# EAGLE design optical meter reader (EAGLE 7.3.0)
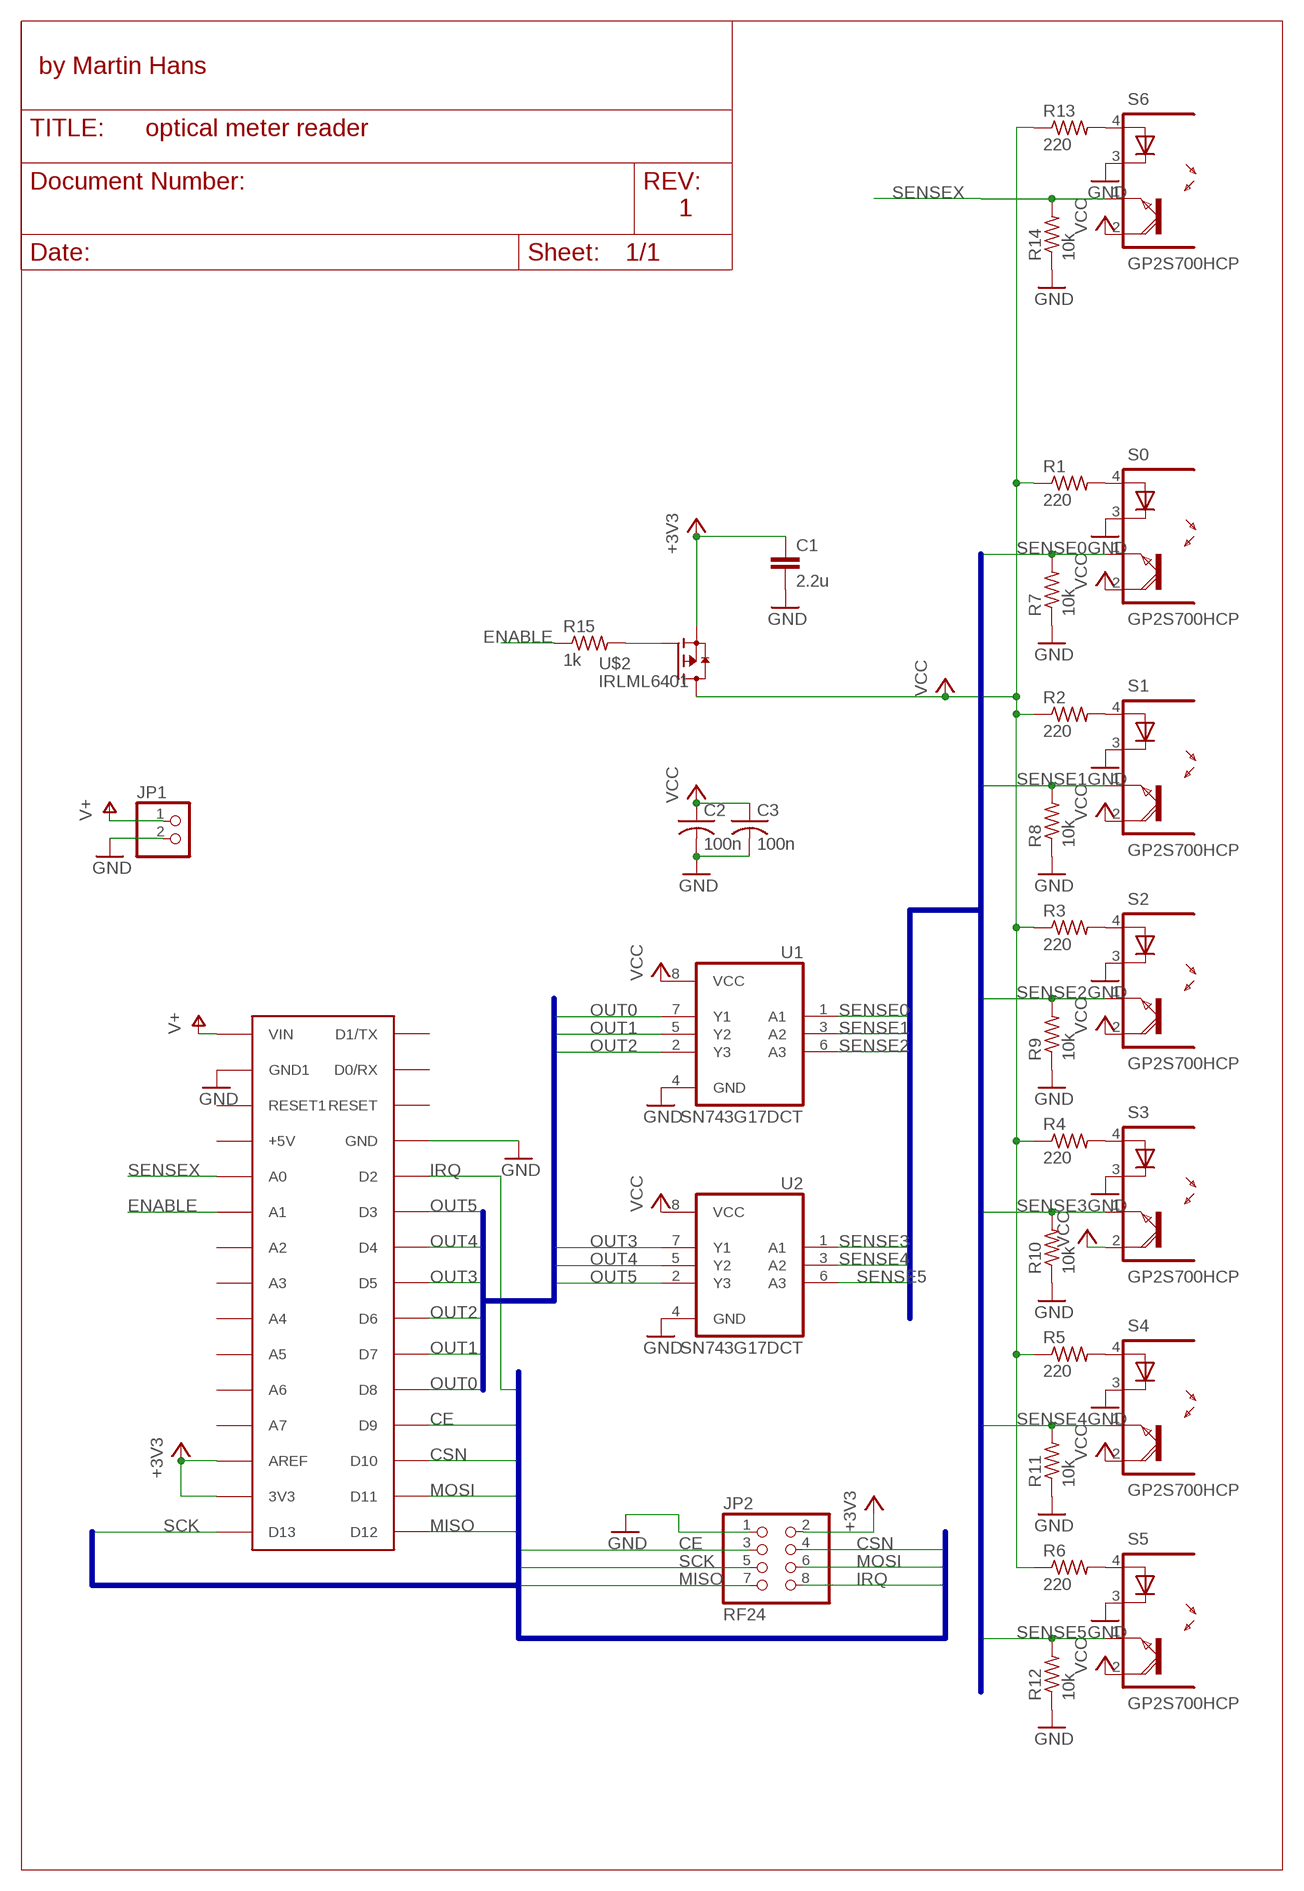
[diagram p0: schematic, sheet 1]

## Parts
C1  2.2u  C-EUC0603  [C0603]
C2  100n  C-USC0603  [C0603]
C3  100n  C-USC0603  [C0603]
JP1  PINHD-1X2  [1X02]
JP2  RF24  PINHD-2X4  [2X04]
R1  220  R-US_R0603  [R0603]
R2  220  R-US_R0603  [R0603]
R3  220  R-US_R0603  [R0603]
R4  220  R-US_R0603  [R0603]
R5  220  R-US_R0603  [R0603]
R6  220  R-US_R0603  [R0603]
R7  10k  R-US_R0603  [R0603]
R8  10k  R-US_R0603  [R0603]
R9  10k  R-US_R0603  [R0603]
R10  10k  R-US_R0603  [R0603]
R11  10k  R-US_R0603  [R0603]
R12  10k  R-US_R0603  [R0603]
R13  220  R-US_R0603  [R0603]
R14  10k  R-US_R0603  [R0603]
R15  1k  R-US_R0603  [R0603]
S0  GP2S700HCP  [SMD]
S1  GP2S700HCP  [SMD]
S2  GP2S700HCP  [SMD]
S3  GP2S700HCP  [SMD]
S4  GP2S700HCP  [SMD]
S5  GP2S700HCP  [SMD]
S6  GP2S700HCP  [SMD]
U1  SN743G17DCT  [SSOP08]
U2  SN743G17DCT  [SSOP08]
U$1  ARDUINONANO  [PDIP-32]
U$2  IRLML6401  [SOT23]

## Nets
+3V3: C1.1 JP2.2 U$1.3V3 U$1.AREF U$2.2(S)
CE: JP2.3 U$1.D9
CSN: JP2.4 U$1.D10
ENABLE: R15.1 U$1.A1
GND: C1.2 C2.2 C3.2 JP1.2 JP2.1 R7.1 R8.1 R9.1 R10.1 R11.1 R12.1 R14.1 S0.3(C) S1.3(C) S2.3(C) S3.3(C) S4.3(C) S5.3(C) S6.3(C) U1.4(GND) U2.4(GND) U$1.GND U$1.GND1
IRQ: JP2.8 U$1.D2
MISO: JP2.7 U$1.D12
MOSI: JP2.6 U$1.D11
N$1: R1.2 S0.4(A)
N$2: R2.2 S1.4(A)
N$3: R3.2 S2.4(A)
N$4: R4.2 S3.4(A)
N$5: R5.2 S4.4(A)
N$6: R13.2 S6.4(A)
N$7: R15.2 U$2.1(G)
N$8: R6.2 S5.4(A)
OUT0: U1.7(Y1) U$1.D8
OUT1: U1.5(Y2) U$1.D7
OUT2: U1.2(Y3) U$1.D6
OUT3: U2.7(Y1) U$1.D5
OUT4: U2.5(Y2) U$1.D4
OUT5: U2.2(Y3) U$1.D3
SCK: JP2.5 U$1.D13
SENSE0: R7.2 S0.1(EMI) U1.1(A1)
SENSE1: R8.2 S1.1(EMI) U1.3(A2)
SENSE2: R9.2 S2.1(EMI) U1.6(A3)
SENSE3: R10.2 S3.1(EMI) U2.1(A1)
SENSE4: R11.2 S4.1(EMI) U2.3(A2)
SENSE5: R12.2 S5.1(EMI) U2.6(A3)
SENSEX: R14.2 S6.1(EMI) U$1.A0
V+: JP1.1 U$1.VIN
VCC: C2.1 C3.1 R1.1 R2.1 R3.1 R4.1 R5.1 R6.1 R13.1 S0.2(COL) S1.2(COL) S2.2(COL) S3.2(COL) S4.2(COL) S5.2(COL) S6.2(COL) U1.8(VCC) U2.8(VCC) U$2.3(D)
Unconnected: U$1.+5V U$1.A2 U$1.A3 U$1.A4 U$1.A5 U$1.A6 U$1.A7 U$1.D0/RX U$1.D1/TX U$1.RESET U$1.RESET1

## Buses
SENSE[0..5]
OUT[0..5]
CSN,CE,MOSI,MISO,SCK,IRQ

## Notes on the sheet
- by Martin Hans
- 1

## Library data of the parts
C1 = rcl:C-EU: CAPACITOR, European symbol
C2 C3 = rcl:C-US: CAPACITOR, American symbol
JP1 = pinhead:PINHD-1X2: PIN HEADER
JP2 = pinhead:PINHD-2X4: PIN HEADER
R1-R15 = adafruit:R-US_: RESISTOR, American symbol
S0 S1-S6 = optoelectronics:GP2S700HCP
U1 U2 = logic:SN74*3G17
U$1 = arduino:ARDUINONANO
U$2 = transistors:IRLML6401

## Board
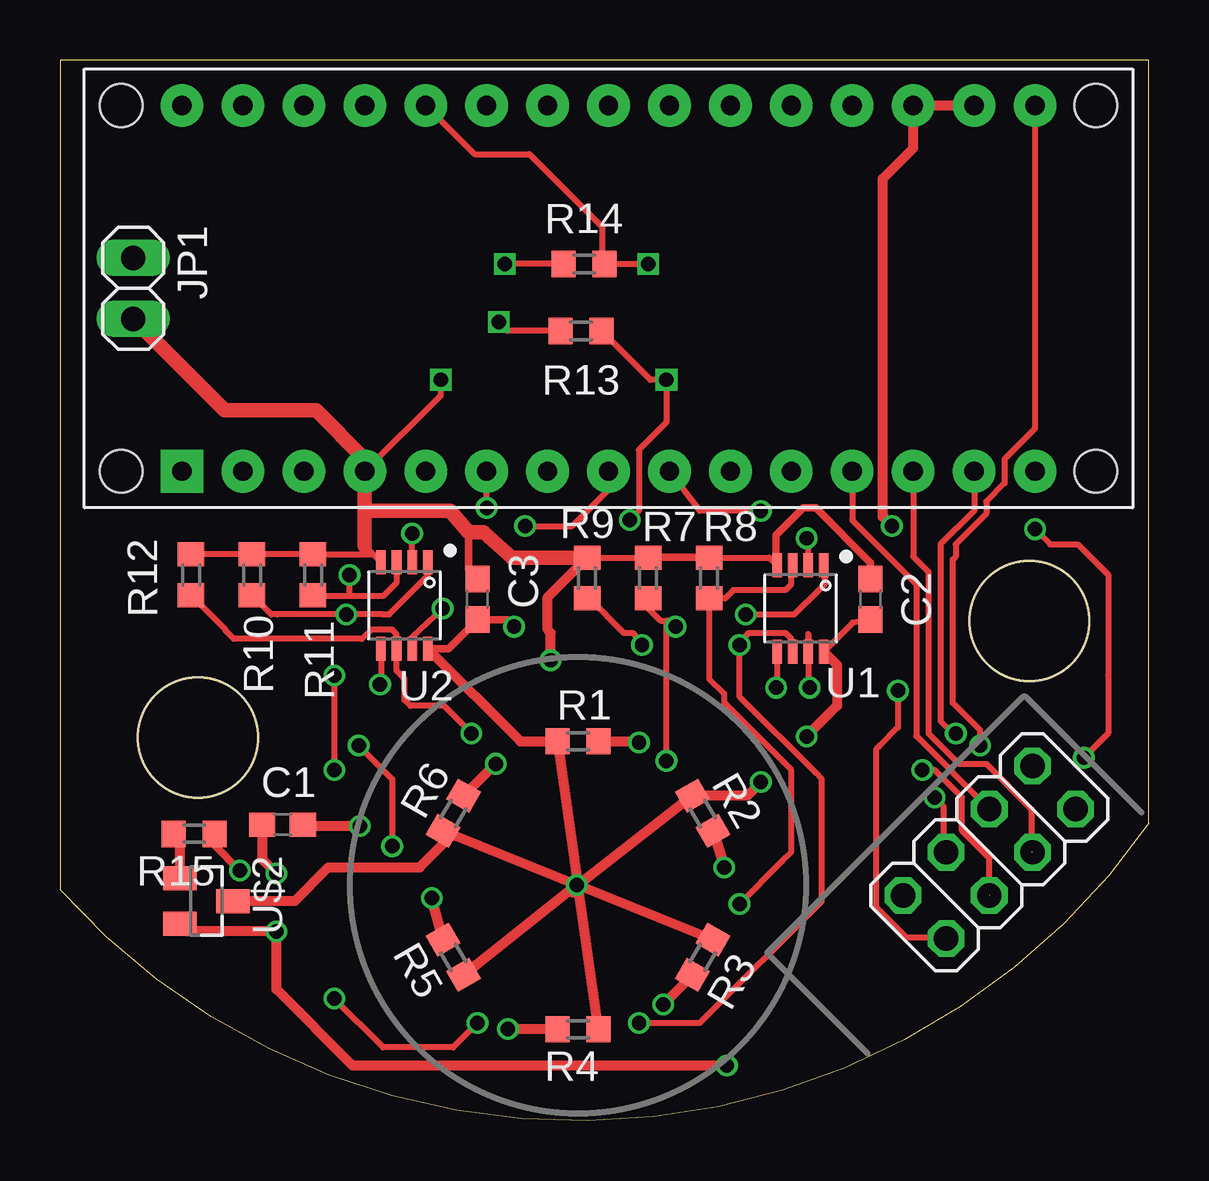
[diagram p1: board, top side]
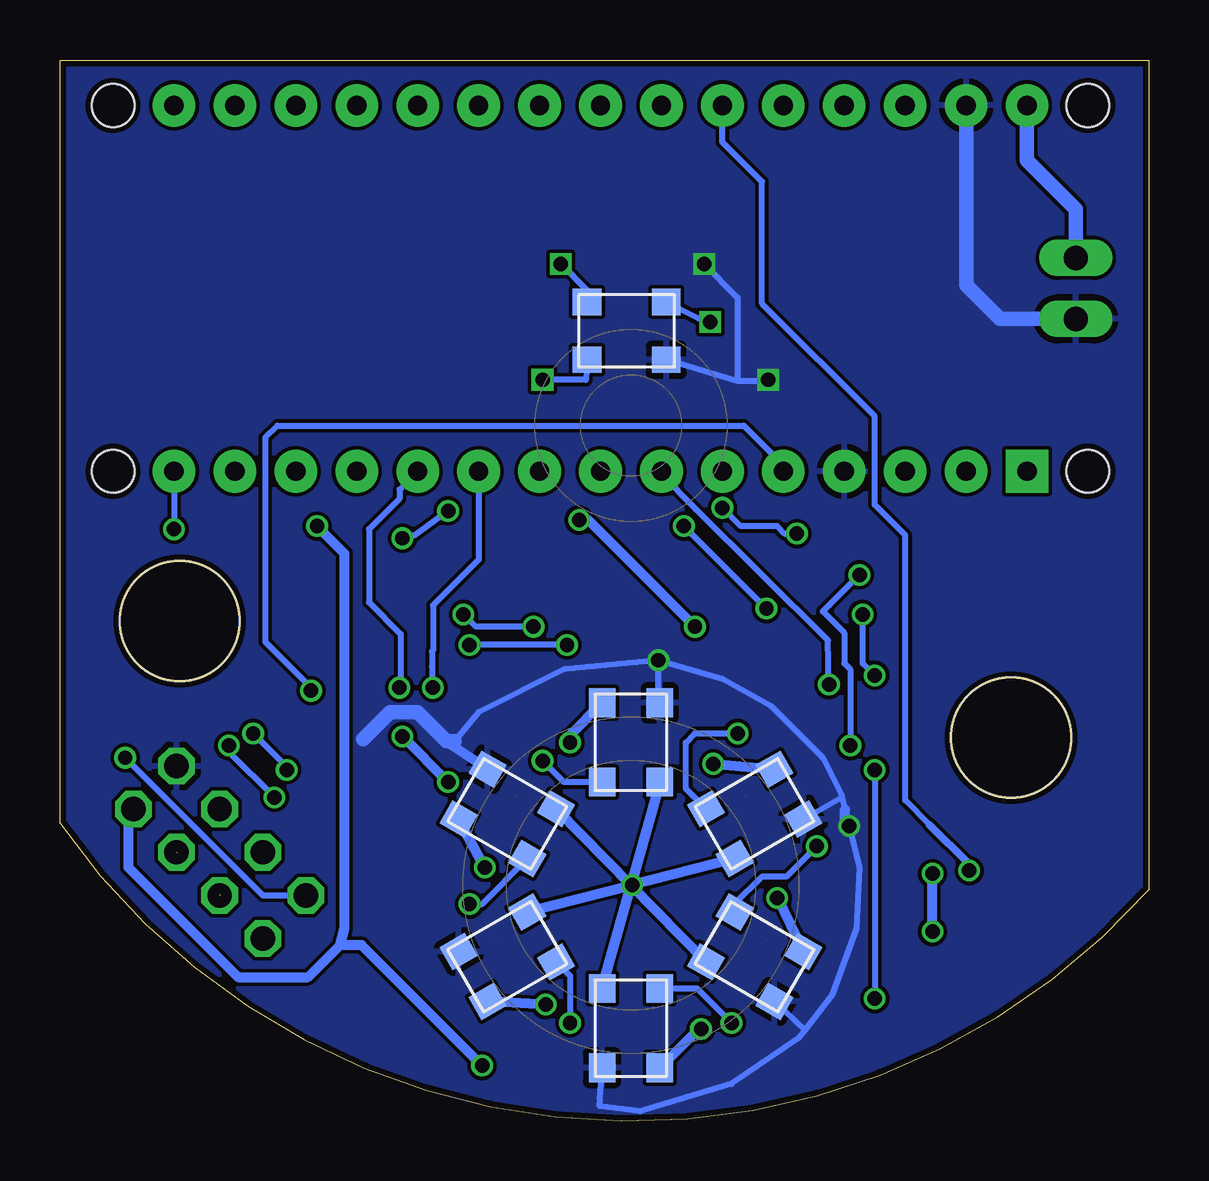
[diagram p2: board, bottom side, seen from below]

Size 45.4 x 44.21 mm. Coordinates in mm from the lower left corner, seen from the top.
Outline: 45.4,12.4 45.39,44.21 0,44.21 0,9.63 arc103 45.4,12.4
Outline: circle at 40.41,20.83 radius 2.5
Outline: circle at 5.75,15.97 radius 2.5
Copper layers (1*16): Top 0.035mm / dielectric 1.5mm / Bottom 0.035mm
Design rules "SeeedStudio_2layer_DRU_no_angle_20140221": minimum track width 6mil, minimum drill 12mil, track to track 6mil, track to pad 6mil, pad to pad 6mil, via to via 6mil, smd to smd 0mil, copper to edge 10mil, drill to drill 10mil, minimum pad ring 10mil, minimum via ring 6mil, stop-mask expansion 2mil, vias tented up to drill 100mil, thermal gap 10mil
Holes 5 mm at 5.75,15.97 40.41,20.83

### Footprints (pad centres in the part's own frame; a part is rotated, then mirrored left to right if it is on the bottom)
C0603 = smd 1.1 x 1: 1 -0.85,0; 2 0.85,0
1X02 = drill 1.016 long: 1 -1.27,0; 2 1.27,0
2X04 = drill 1.016 octagon: 1 -3.81,-1.27; 2 -3.81,1.27; 3 -1.27,-1.27; 4 -1.27,1.27; 5 1.27,-1.27; 6 1.27,1.27; 7 3.81,-1.27; 8 3.81,1.27
R0603 = smd 1 x 1.1: 1 -0.85,0; 2 0.85,0
SMD = smd 1.2 x 1.1: 1 -1.7,1.2; 2 -1.7,-1.2; 3 1.6,-1.2; 4 1.6,1.2
SSOP08 = smd 0.4 x 1: 1 -0.975,-1.8; 2 -0.325,-1.8; 3 0.325,-1.8; 4 0.975,-1.8; 5 0.975,1.8; 6 0.325,1.8; 7 -0.325,1.8; 8 -0.975,1.8
PDIP-32 = drill 0.8 pad 1.778: 3V3 15.24,-35.56; +5V 15.24,-10.16; A0 15.24,-12.7; A1 15.24,-15.24; A2 15.24,-17.78; A3 15.24,-20.32; A4 15.24,-22.86; A5 15.24,-25.4; A6 15.24,-27.94; A7 15.24,-30.48; AREF 15.24,-33.02; D0/RX 0,-5.08; D2 0,-12.7; D3 0,-15.24; D4 0,-17.78; D5 0,-20.32; D6 0,-22.86; D7 0,-25.4; D8 0,-27.94; D9 0,-30.48; D10 0,-33.02; D11 0,-35.56; D12 0,-38.1; D13 15.24,-38.1; GND 0,-10.16; GND1 15.24,-5.08; RESET 0,-7.62; RESET1 15.24,-7.62; VIN 15.24,-2.54 | drill 0.8 pad 1.778 square: D1/TX 0,-2.54 | hole 1.778: 0,0; 0,-40.64; 15.24,-40.64; 15.24,0
SOT23 = smd 1 x 1.4: 1 -0.95,-1.1; 2 0.95,-1.1; 3 0,1.1

### Placement (x,y rotation side)
C1  9.28,12.34 0 top
C2  33.79,21.74 90 top
C3  17.4,21.74 90 top
JP1  3.05,34.69 270 top
JP2  38.74,11.2 225 top
R1  21.59,15.82 0 top
R2  26.79,12.82 300 top
R3  26.79,6.82 240 top
R4  21.59,3.82 180 top
R5  16.4,6.82 120 top
R6  16.4,12.82 60 top
R7  24.52,22.63 270 top
R8  27.06,22.63 270 top
R9  21.98,22.63 270 top
R10  8.01,22.75 270 top
R11  10.55,22.75 270 top
R12  5.47,22.75 270 top
R13  21.72,32.92 180 top
R14  21.85,35.71 0 top
R15  5.59,11.96 180 top
S0  21.59,15.82 90 bottom
S1  26.79,12.82 150 bottom
S2  26.79,6.82 210 bottom
S3  21.59,3.82 270 bottom
S4  16.4,6.82 330 bottom
S5  16.4,12.82 30 bottom
S6  21.72,32.92 0 bottom
U1  30.87,21.36 180 top
U2  14.36,21.48 180 top
U$1  2.54,27.07 90 top
U$2  6.1,9.17 270 top

### Tracks (layer width: path | path; a pad name or v marks a point on that pad's centre or on a via)
+3V3  (via drill 0.6)
  Top 0.406: v34.68,24.79 34.29,25.17 34.29,39.26 35.56,40.53 U$1.AREF U$1.3V3 | v27.8,2.31 12.2,2.31 9.02,5.48 v9.02,7.9 5.32,7.9 U$2.2 | C1.1 8.43,10.9 v9.02,10.31
  Bottom 0.406: v9.02,7.9 v9.02,10.31 | v34.68,24.79 33.53,23.64 33.53,8.02 33.72,7.32 | JP2.2 42.55,12.78 42.55,10.56 37.98,5.99 35.06,5.99 33.72,7.32 | v27.8,2.31 32.82,7.32 33.72,7.32
CE
  Top 0.254: U$1.D9 33.02,25.04 35.69,22.37 35.69,16.04 JP2.3
CSN  (1 unrouted)
  Top 0.254: U$1.D10 35.56,23.52 36.2,22.88 36.2,16.15 37.47,14.88 38.61,14.88 40.52,12.98 40.52,11.2 JP2.4
ENABLE  (via drill 0.6)
  Top 0.305: R15.1 6.44,11.49 v7.5,10.44
  Bottom 0.254: 9.15,12.34 10.16,13.36 10.16,24.41 11.43,25.68 11.43,29.36 16.13,34.06 16.13,39.14 17.78,40.79 U$1.A1
  Bottom 0.305: v7.5,10.44 7.5,10.69 9.15,12.34
GND  (via drill 0.6)
  Top 0.254: R9.1 R7.1 | R7.1 R8.1 | R8.1 29.57,23.48 U1.4 | 13.06,23.6 U2.4 13.06,23.6 | R12.1 R10.1 R11.1 13.06,23.6 | 13.06,23.6 12.7,23.96 | U$1.GND 15.88,30.25 v15.88,30.88 | R14.1 v18.55,35.71 | R8.1 27.06,23.52 24.55,23.52 R7.1
  Top 0.305: U1.4 29.85,23.2 29.85,24.41 30.99,25.55 31.5,25.55 33.79,23.26 C2.2 | C3.2 17.02,22.97 17.02,24.53
  Top 0.406: C1.2 10.17,12.3 v12.5,12.3 | v20.45,19.2 20.45,20.34 20.32,20.47 20.32,21.83 R9.1
  Top 0.61: 12.7,23.96 12.7,25.42 | 12.7,25.42 U$1.GND 12.7,27.58 10.67,29.61 6.86,29.61 JP1.2 | 12.7,25.42 12.96,25.42 16.26,25.42 17.02,24.53 17.66,24.53 18.84,23.48 R9.1
  Bottom 0.254: v15.88,30.88 15.94,30.83 17.15,30.83 | 17.15,30.83 S6.3 | v18.55,35.71 17.15,34.31 17.15,30.83 | S0.3 20.45,17.48 v20.45,19.2 | v20.45,19.2 24.39,18.82 27.94,17.04 28.96,15.83 29.09,15.67 | v20.45,19.2 17.78,18.44 15.75,17.29 13.59,15.13 12.83,13.61 12.8,13.49 | 12.8,13.49 12.67,12.98 v12.5,12.3 12.07,10.56 12.2,8.02 13.21,5.23 14.35,3.78 | 14.35,3.78 14.61,3.45 17.4,1.55 21.21,0.4 22.9,0.62 S3.3 | S4.3 14.35,3.78 | S5.3 12.8,13.49
  Bottom 0.406: S1.3 29.09,15.67 | S2.3 28.96,6.88 | v12.5,12.3 12.67,12.47 12.67,12.98
  Bottom 0.61: JP1.2 6.23,33.42 7.62,34.82 U$1.GND1 | 32.77,15.9 31.63,17.04 30.48,17.04 29.27,15.83 28.96,15.83
  pour Bottom: 0.13,44.09 45.34,44.09 45.34,-0.23 0.13,-0.23
IRQ  (via drill 0.6)
  Top 0.254: JP2.8 36.83,7.64 35.31,7.64 34.04,8.91 34.04,15.52 34.17,15.64 34.93,16.4 v34.93,17.93
  Bottom 0.254: U$1.D2 15.24,27.33 16.9,28.98 36.33,28.98 36.83,28.47 36.83,19.96 34.93,18.06 v34.93,17.93
MISO  (via drill 0.6)
  Top 0.254: 35.18,9.29 JP2.7 | v40.64,24.66 41.28,24.02 42.42,24.02 43.69,22.75 43.69,18.56 43.69,16.15 v42.68,15.13
  Bottom 0.254: U$1.D12 v40.64,24.66 | v42.68,15.13 36.94,9.4 JP2.7
MOSI  (via drill 0.6)  (1 unrouted)
  Top 0.254: U$1.D11 38.1,25.42 36.71,24.02 36.71,16.66 37.22,16.15 v37.34,16.15 | v35.95,14.63 36.45,14.63 37.6,13.48 37.6,12.09 38.74,10.94 38.74,9.42 JP2.6
  Bottom 0.254: v37.34,16.15 35.95,14.75 v35.95,14.63
N$1  (via drill 0.6)
  Top 0.406: R1.2 24.08,15.82 v24.13,15.77
  Bottom 0.406: v24.13,15.77 24.13,16.08 S0.4
N$2  (via drill 0.6)
  Top 0.406: R2.2 v27.69,10.56
  Bottom 0.406: v27.69,10.56 S1.4
N$3  (via drill 0.6)
  Top 0.406: R3.2 v25.15,4.85
  Bottom 0.406: v25.15,4.85 S2.4
N$4  (via drill 0.6)
  Top 0.406: R4.2 v18.67,3.82 v18.67,3.83
  Bottom 0.406: v18.67,3.83 18.78,3.83 S3.4
N$5  (via drill 0.6)  (1 unrouted)
  Top 0.406: R5.2 v15.5,9.29
  Bottom 0.406: v15.5,9.29 S4.4
N$6  (via drill 0.6)
  Top 0.254: R13.2 18.67,32.92 v18.29,33.3
  Bottom 0.254: v18.29,33.3 18.36,33.23 S6.4
N$7
  Top 0.406: U$2.1 5,11.7 R15.2
N$8  (via drill 0.6)  (1 unrouted)
  Top 0.406: R6.2 v18.17,14.88
  Bottom 0.406: v18.17,14.88 S5.4
OUT0  (via drill 0.6)
  Top 0.254: U1.7 31.19,20.29 31.19,18.11 v31.25,18.06
  Bottom 0.254: U$1.D8 31.25,26.31 31.25,25.93 32.52,24.66 32.52,21.61 31.19,20.29 31.19,18.11 v31.25,18.06
OUT1  (via drill 0.6)
  Top 0.254: U1.5 29.89,18.1 v29.85,18.06
  Bottom 0.254: U$1.D7 27.94,23.39 29.85,21.48 29.85,19.6 U1.5 29.89,18.94 29.89,18.1 v29.85,18.06
OUT2  (via drill 0.6)
  Top 0.254: U1.2 31.19,24.21 v31.12,24.28 | v29.21,25.42 26.67,25.42 U$1.D6
  Bottom 0.254: v31.12,24.28 31.12,24.41 30.61,24.41 v29.21,25.42
OUT3  (via drill 0.6)
  Top 0.254: U2.7 14.68,20.16 v15.95,21.35 | v19.39,24.79 21.34,24.79 22.86,26.31 U$1.D5
  Bottom 0.254: v15.95,21.35 v19.39,24.79
OUT4  (via drill 0.6)
  Top 0.254: U2.5 13.38,18.22 v13.34,18.18
  Bottom 0.254: v13.34,18.18 13.38,20.02 18.91,25.51 20.32,26.95 U$1.D4
OUT5  (via drill 0.6)
  Top 0.254: U2.2 v14.68,24.48 | v17.78,25.55 U$1.D3
  Bottom 0.254: v17.78,25.55 17.02,24.79 15.5,24.79 15.19,24.48 v14.68,24.48
SCK  (via drill 0.6)
  Top 0.254: v38.36,15.64 38.36,16.28 37.22,17.42 37.22,23.39 37.34,23.52 37.34,24.02 38.61,25.29 38.61,25.8 39.37,26.56 39.37,27.58 40.64,28.85 U$1.D13 | v36.45,13.48 36.83,13.1 36.83,11.2 JP2.5
  Bottom 0.254: v38.36,15.64 38.36,15.39 v36.45,13.48
SENSE0  (via drill 0.6)
  Top 0.254: R7.2 24.52,21.36 25.02,20.85 25.28,20.85 | U1.1 31.88,23.12 31.88,22.37 31.69,22.18 30.61,21.1 v28.58,21.1 | v25.28,15.01 25.28,20.85 | 25.28,20.85 25.4,20.85 v25.66,20.6
  Bottom 0.254: S0.1 24.39,14.12 v25.28,15.01 | v25.66,20.6 28.07,20.6 v28.58,21.1
SENSE1  (via drill 0.6)
  Top 0.254: U1.3 30.48,23.1 30.48,22.37 30.23,22.12 28.07,22.12 27.73,21.78 R8.2 27.06,18.44 27.69,17.8 27.69,17.42 30.48,14.63 30.48,11.2 30.1,10.82 v28.33,9.04
  Bottom 0.254: v28.33,9.04 27.81,9.04 S1.1
SENSE2  (via drill 0.6)
  Top 0.254: R9.2 22.06,21.78 23.5,20.34 23.88,20.34 v24.26,19.83 | U1.6 30.48,19.61 30.48,20.09 30.23,20.34 28.71,20.34 v28.33,19.83 28.33,17.67 31.5,14.5 | 31.75,14.25 31.5,14.5 | v24.13,4.09 26.67,4.09 31.75,9.17 31.75,14.25 | 31.75,14.25 31.5,14.5
  Bottom 0.254: v24.26,19.83 v28.33,19.83 | S2.1 24.13,6.05 v24.13,4.09
SENSE3  (via drill 0.6)
  Top 0.254: U2.1 15.33,22.71 13.72,21.1 13.47,21.1 v11.94,21.1 9.06,21.1 8.81,21.1 R10.2 | v17.4,4.09 16.39,3.07 13.47,3.07 v11.43,5.1 | v11.43,18.56 v11.43,14.63
  Bottom 0.254: S3.1 18.84,5.52 v17.4,4.09 | v11.94,21.1 11.94,19.07 v11.43,18.56 | v11.43,14.63 v11.43,5.1
SENSE4  (via drill 0.6)
  Top 0.254: U2.3 14.03,22.43 13.47,21.87 12.07,21.87 | 12.07,21.87 10.58,21.87 R11.2 | 12.07,21.87 v12.07,22.75 | v12.45,15.64 13.85,14.25 v13.85,11.45
  Bottom 0.254: v12.07,22.75 13.34,21.48 13.59,21.23 12.7,20.34 12.7,19.07 12.45,18.82 v12.45,15.64 | v13.85,11.45 15.12,10.18 16.13,10.18 17.27,9.04 S4.1
SENSE5  (via drill 0.6)
  Top 0.254: R12.2 6.9,20.47 6.9,20.43 7.24,20.09 12.58,20.09 12.96,20.47 13.85,20.47 14.03,20.29 U2.6 14.03,18.76 14.36,18.44 14.36,17.55 14.61,17.29 16.01,17.29 v17.15,16.15
  Bottom 0.254: S5.1 19.31,13.85 19.31,15.77 18.93,16.15 v17.15,16.15
SENSEX  (via drill 0.6)
  Top 0.254: v24.52,35.71 R14.2 22.61,35.8 22.61,37.23 19.56,40.28 17.28,40.28 U$1.A0
  Bottom 0.254: v24.52,35.71 23.42,34.61 S6.1
V+
  Bottom 0.61: JP1.1 3.05,37.99 5.08,40.03 U$1.VIN
VCC  (via drill 0.6)  (2 unrouted)
  Top 0.254: v23.75,25.04 24.13,25.42 24.13,27.96 25.28,29.1 v25.28,30.88 24.61,30.88 R13.1 | C2.1 33.04,20.76 U1.8
  Top 0.305: v18.93,20.6 18.63,20.89 C3.1 16.2,19.68 U2.8
  Top 0.406: R5.1 v21.54,9.83 | v21.54,9.83 21.59,9.82 | R6.1 16.48,11.88 | 16.48,11.88 21.59,9.82 | R4.1 21.64,9.53 | 21.64,9.53 21.59,9.82 | R3.1 21.59,9.82 | 21.59,9.82 R2.1 28.65,13.56 v29.21,14.12 | 21.58,9.93 R1.1 19.19,15.82 U2.8 | 21.58,9.93 21.59,9.82 | 21.59,9.82 21.59,9.91 21.58,9.93 | v21.54,9.83 21.33,9.53 21.64,9.53 | 16.48,11.88 16.31,11.88 14.99,10.56 11.18,10.56 9.78,9.17 U$2.3 | U1.8 32.39,19.01 32.39,17.29 v31.12,16.02
  Bottom 0.254: S6.2 23.48,30.88 v25.28,30.88
  Bottom 0.406: S0.2 21.59,9.82 | S5.2 21.59,9.82 | S1.2 21.59,9.82 | S2.2 21.59,9.82 | S3.2 21.59,9.82 | S4.2 21.59,9.82 | 21.59,9.82 21.35,9.58 v21.54,9.83 | v23.75,25.04 23.37,25.04 v18.93,20.6 | v31.12,16.02 v29.21,14.12

### Text on the board
tDocu: Arduino Nano | USB | RF24
bDocu: Continuous water meter reader / Rev. 1 / (c) 2015 Martin Hans